# Altium schematic sheet Communications.SchDoc
size A; SheetNumber: 2; SheetTotal: 7
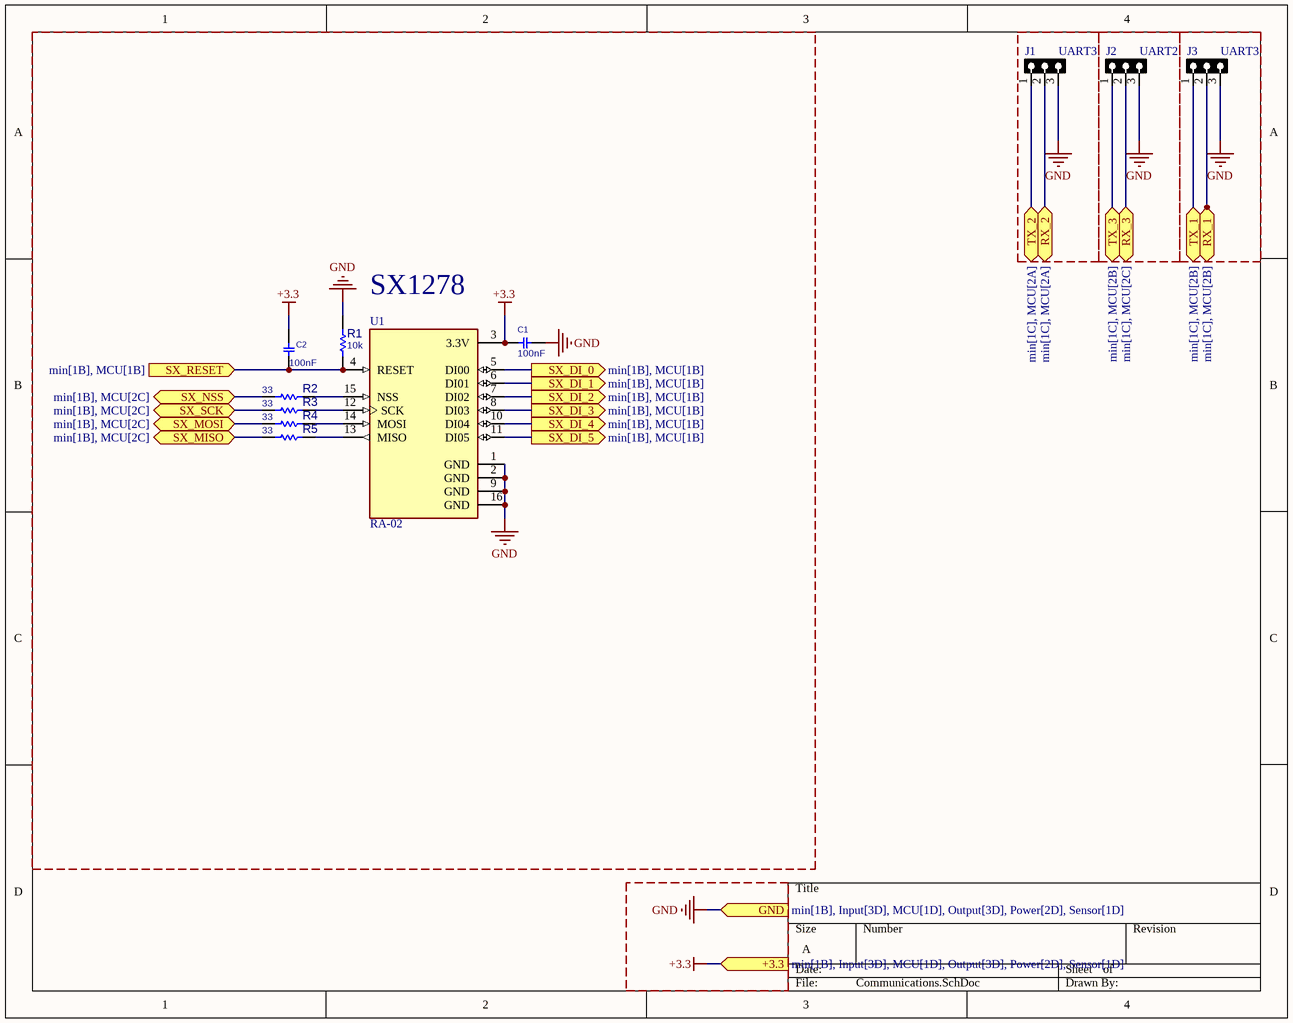
[diagram p0: Communications.SchDoc]

## Parts
C1  100nF  [C1206]
C2  100nF  [C1206]
J1  UART3  [HDR_F_1X3]
J2  UART2  [HDR_F_1X3]
J3  UART3  [HDR_F_1X3]
R1  10k  [R1206]
R2  33  [R1206]
R3  33  [R1206]
R4  33  [R1206]
R5  33  [R1206]
U1  RA-02  [RA-02]

## Ports
+3.3 (in, see min[1B], Input[3D], MCU[1D], Output[3D], Power[2D], Sensor[1D]), GND (in, see min[1B], Input[3D], MCU[1D], Output[3D], Power[2D], Sensor[1D]), RX_1 (bidir, see min[1C], MCU[2B]), RX_2 (bidir, see min[1C], MCU[2A]), RX_3 (bidir, see min[1C], MCU[2C]), SX_DI_0 (out, see min[1B], MCU[1B]), SX_DI_1 (out, see min[1B], MCU[1B]), SX_DI_2 (out, see min[1B], MCU[1B]), SX_DI_3 (out, see min[1B], MCU[1B]), SX_DI_4 (out, see min[1B], MCU[1B]), SX_DI_5 (out, see min[1B], MCU[1B]), SX_MISO (bidir, see min[1B], MCU[2C]), SX_MOSI (bidir, see min[1B], MCU[2C]), SX_NSS (bidir, see min[1B], MCU[2C]), SX_RESET (in, see min[1B], MCU[1B]), SX_SCK (bidir, see min[1B], MCU[2C]), TX_1 (bidir, see min[1C], MCU[2B]), TX_2 (bidir, see min[1C], MCU[2A]), TX_3 (bidir, see min[1C], MCU[2B])

## Nets
+3.3: C1.1 C2.1 U1.3(3.3V) ; port +3.3
GND: C1.2 J1.3 J2.3 J3.3 R1.2 U1.1(GND) U1.2(GND) U1.9(GND) U1.16(GND) ; port GND
RX_1: J3.2 ; port RX_1
RX_2: J1.2 ; port RX_2
RX_3: J2.2 ; port RX_3
SX_DI_0: U1.5(DI00) ; port SX_DI_0
SX_DI_1: U1.6(DI01) ; port SX_DI_1
SX_DI_2: U1.7(DI02) ; port SX_DI_2
SX_DI_3: U1.8(DI03) ; port SX_DI_3
SX_DI_4: U1.10(DI04) ; port SX_DI_4
SX_DI_5: U1.11(DI05) ; port SX_DI_5
SX_MISO: R5.1 ; port SX_MISO
SX_MOSI: R4.1 ; port SX_MOSI
SX_NSS: R2.1 ; port SX_NSS
SX_RESET: C2.2 R1.1 U1.4(RESET) ; port SX_RESET
SX_SCK: R3.1 ; port SX_SCK
TX_1: J3.1 ; port TX_1
TX_2: J1.1 ; port TX_2
TX_3: J2.1 ; port TX_3
NetR2_2: R2.2 U1.15(NSS)
NetR3_2: R3.2 U1.12(SCK)
NetR4_2: R4.2 U1.14(MOSI)
NetR5_2: R5.2 U1.13(MISO)

## Notes on the sheet
- SX1278

## Library data of the parts
C1 C2 = CAP_SMD_MLCC: CAP, MLCC; PARAM: C0G, 10%; DESC: CAP, MLCC, 1nF, 50V, C0G, 10%, 0402; MANF_P#: MANF_PART#; MANF: Murata; PARAM2: 50V; VALUE: 20pF; PRICE: 100= 1$; ASSEMBLY: ASSEMBLY
J1-J3 = HDR_F_1X3: CONN, HEADER, Female, pitch: 2.54mm, 3POS; VALUE: HDRF3
R1-R5 = RES_SMD: RESISTOR, SMD; PARAM: -W; DESC: DESCRIPTION; DIST#: MOUSER; PARAM2: 1%; MANF_P#: -; MANF: -; ASSEMBLY: ASSEMBLY; PRICE: 100= 0.5$
U1 = RA-02: General ISM < 1GHz LoRaâ„¢ Transceiver Module 410MHz ~ 525MHz Antenna Not Included, I-PEX Surface Mount; MF: Ai-Thinker; SnapEDA_Link: https://www.snapeda.com/parts/RA-02/AI-Thinker/view-part/?ref=snap; Package: None; Value: *; MP: RA-02; Check_prices: https://www.snapeda.com/parts/RA-02/AI-Thinker/view-part/?ref=eda